# EAGLE schematic light_controller (EAGLE 8.5.0)
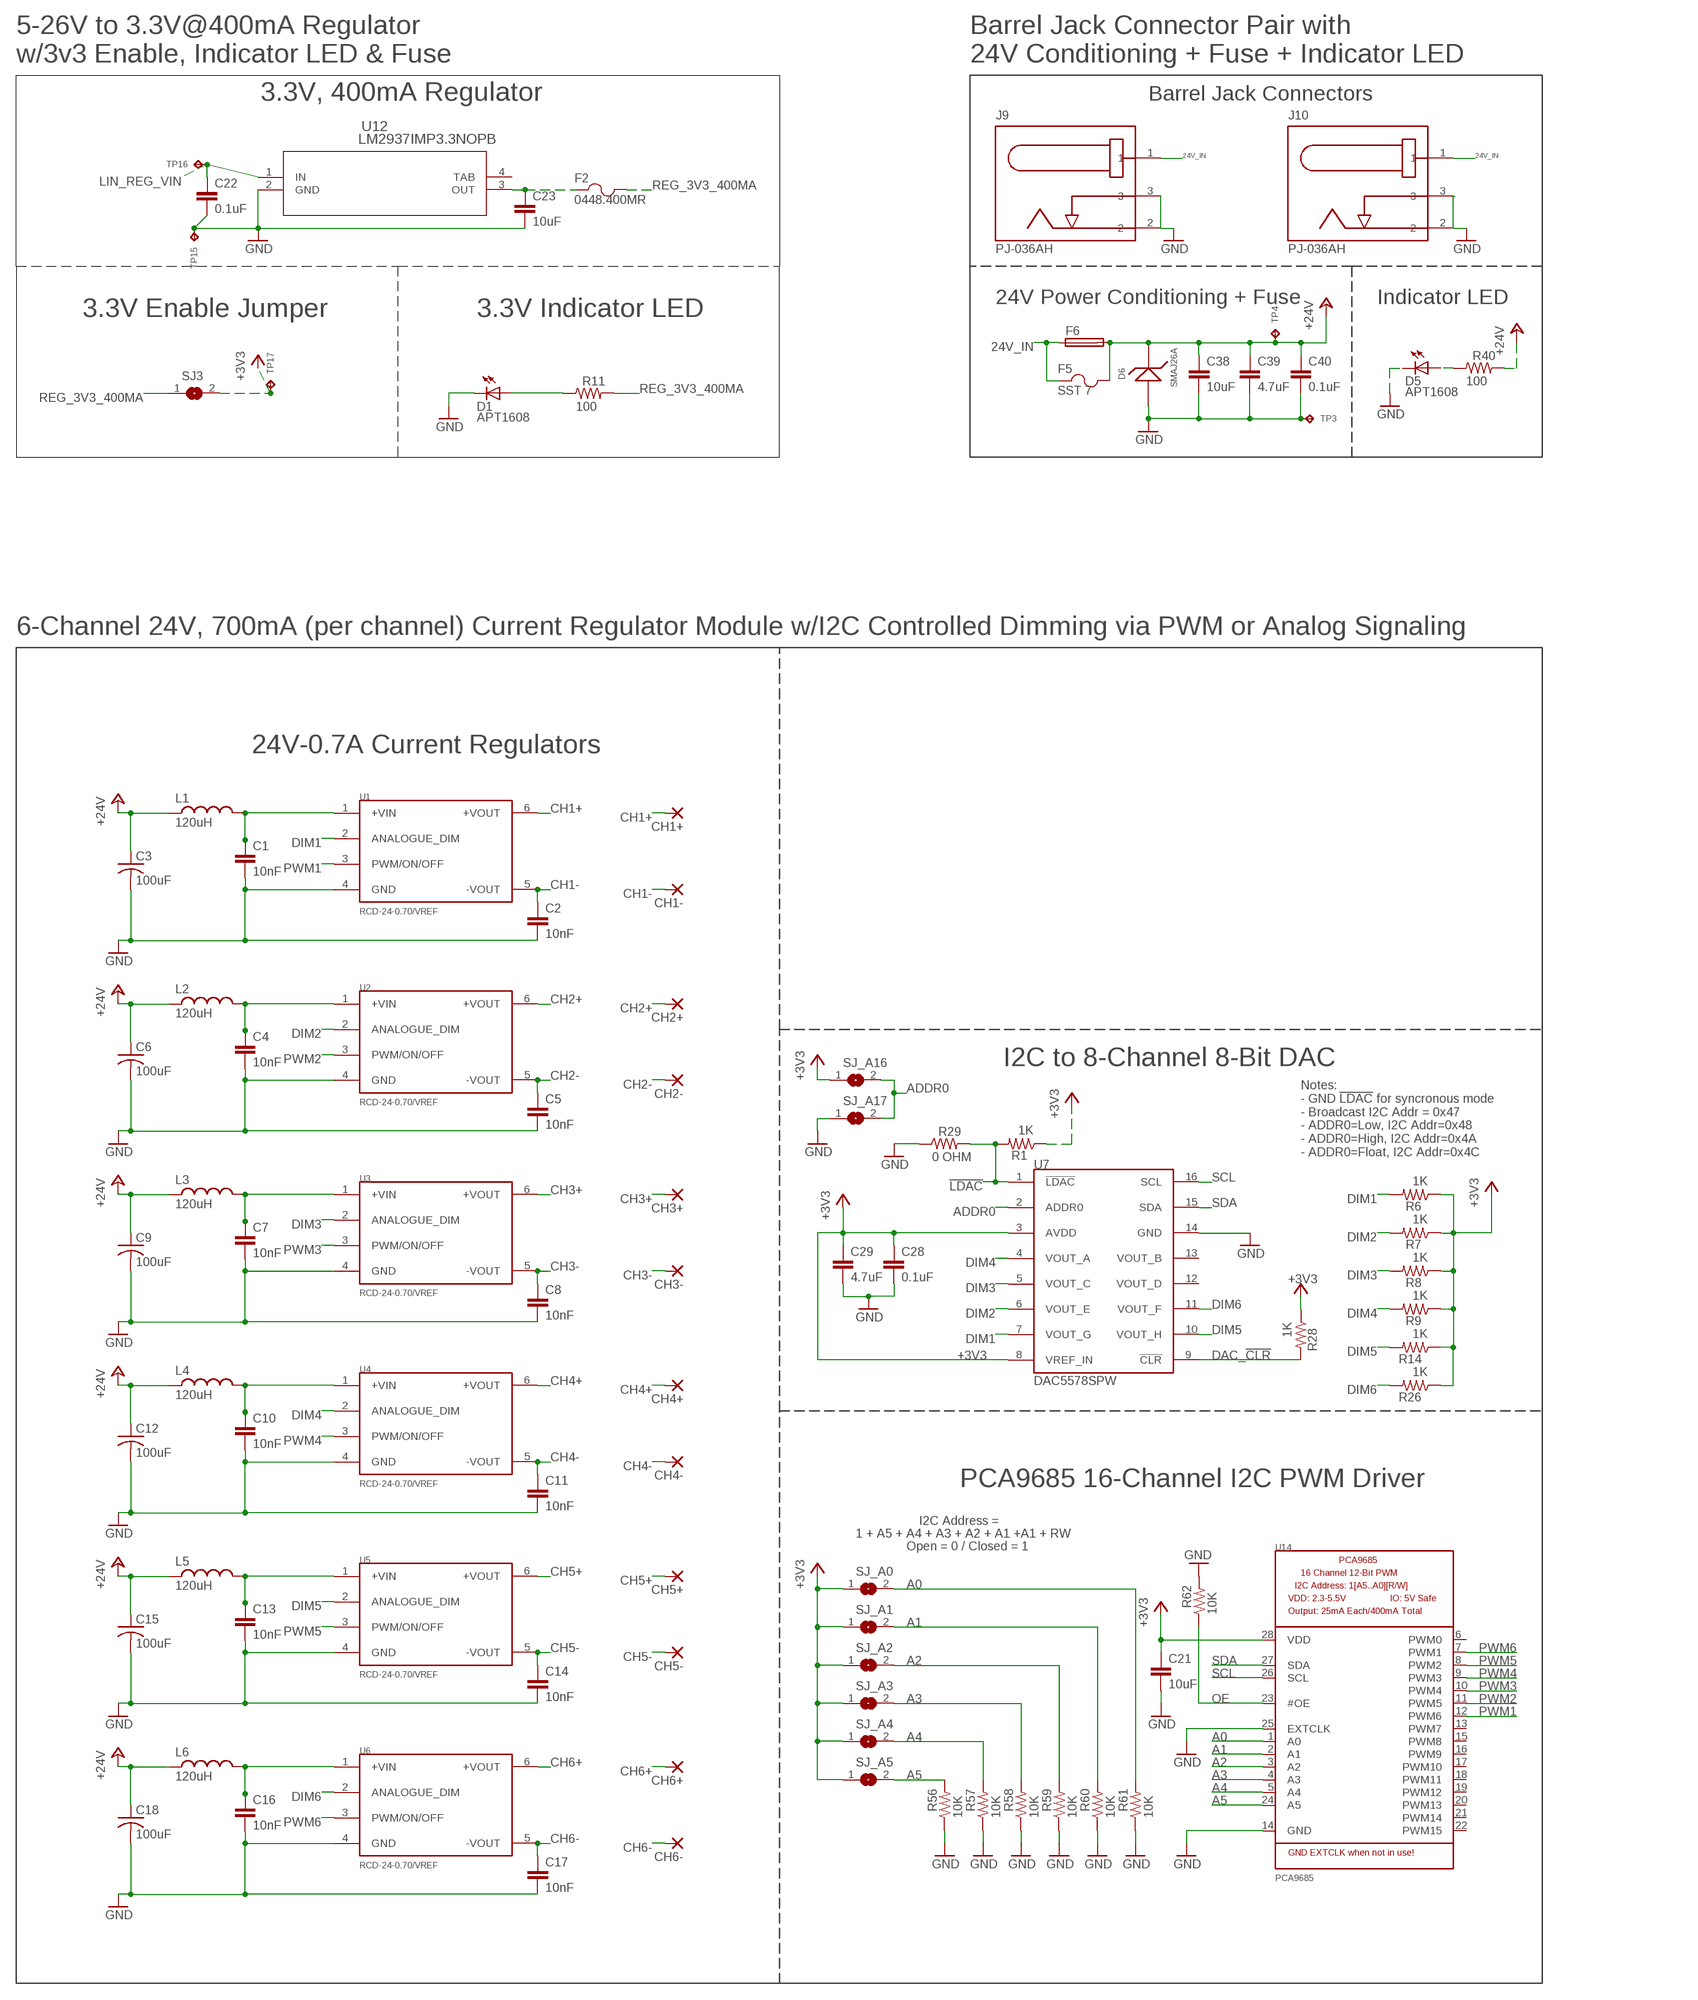
[diagram p0: schematic, sheet 1, part 1 of 2]
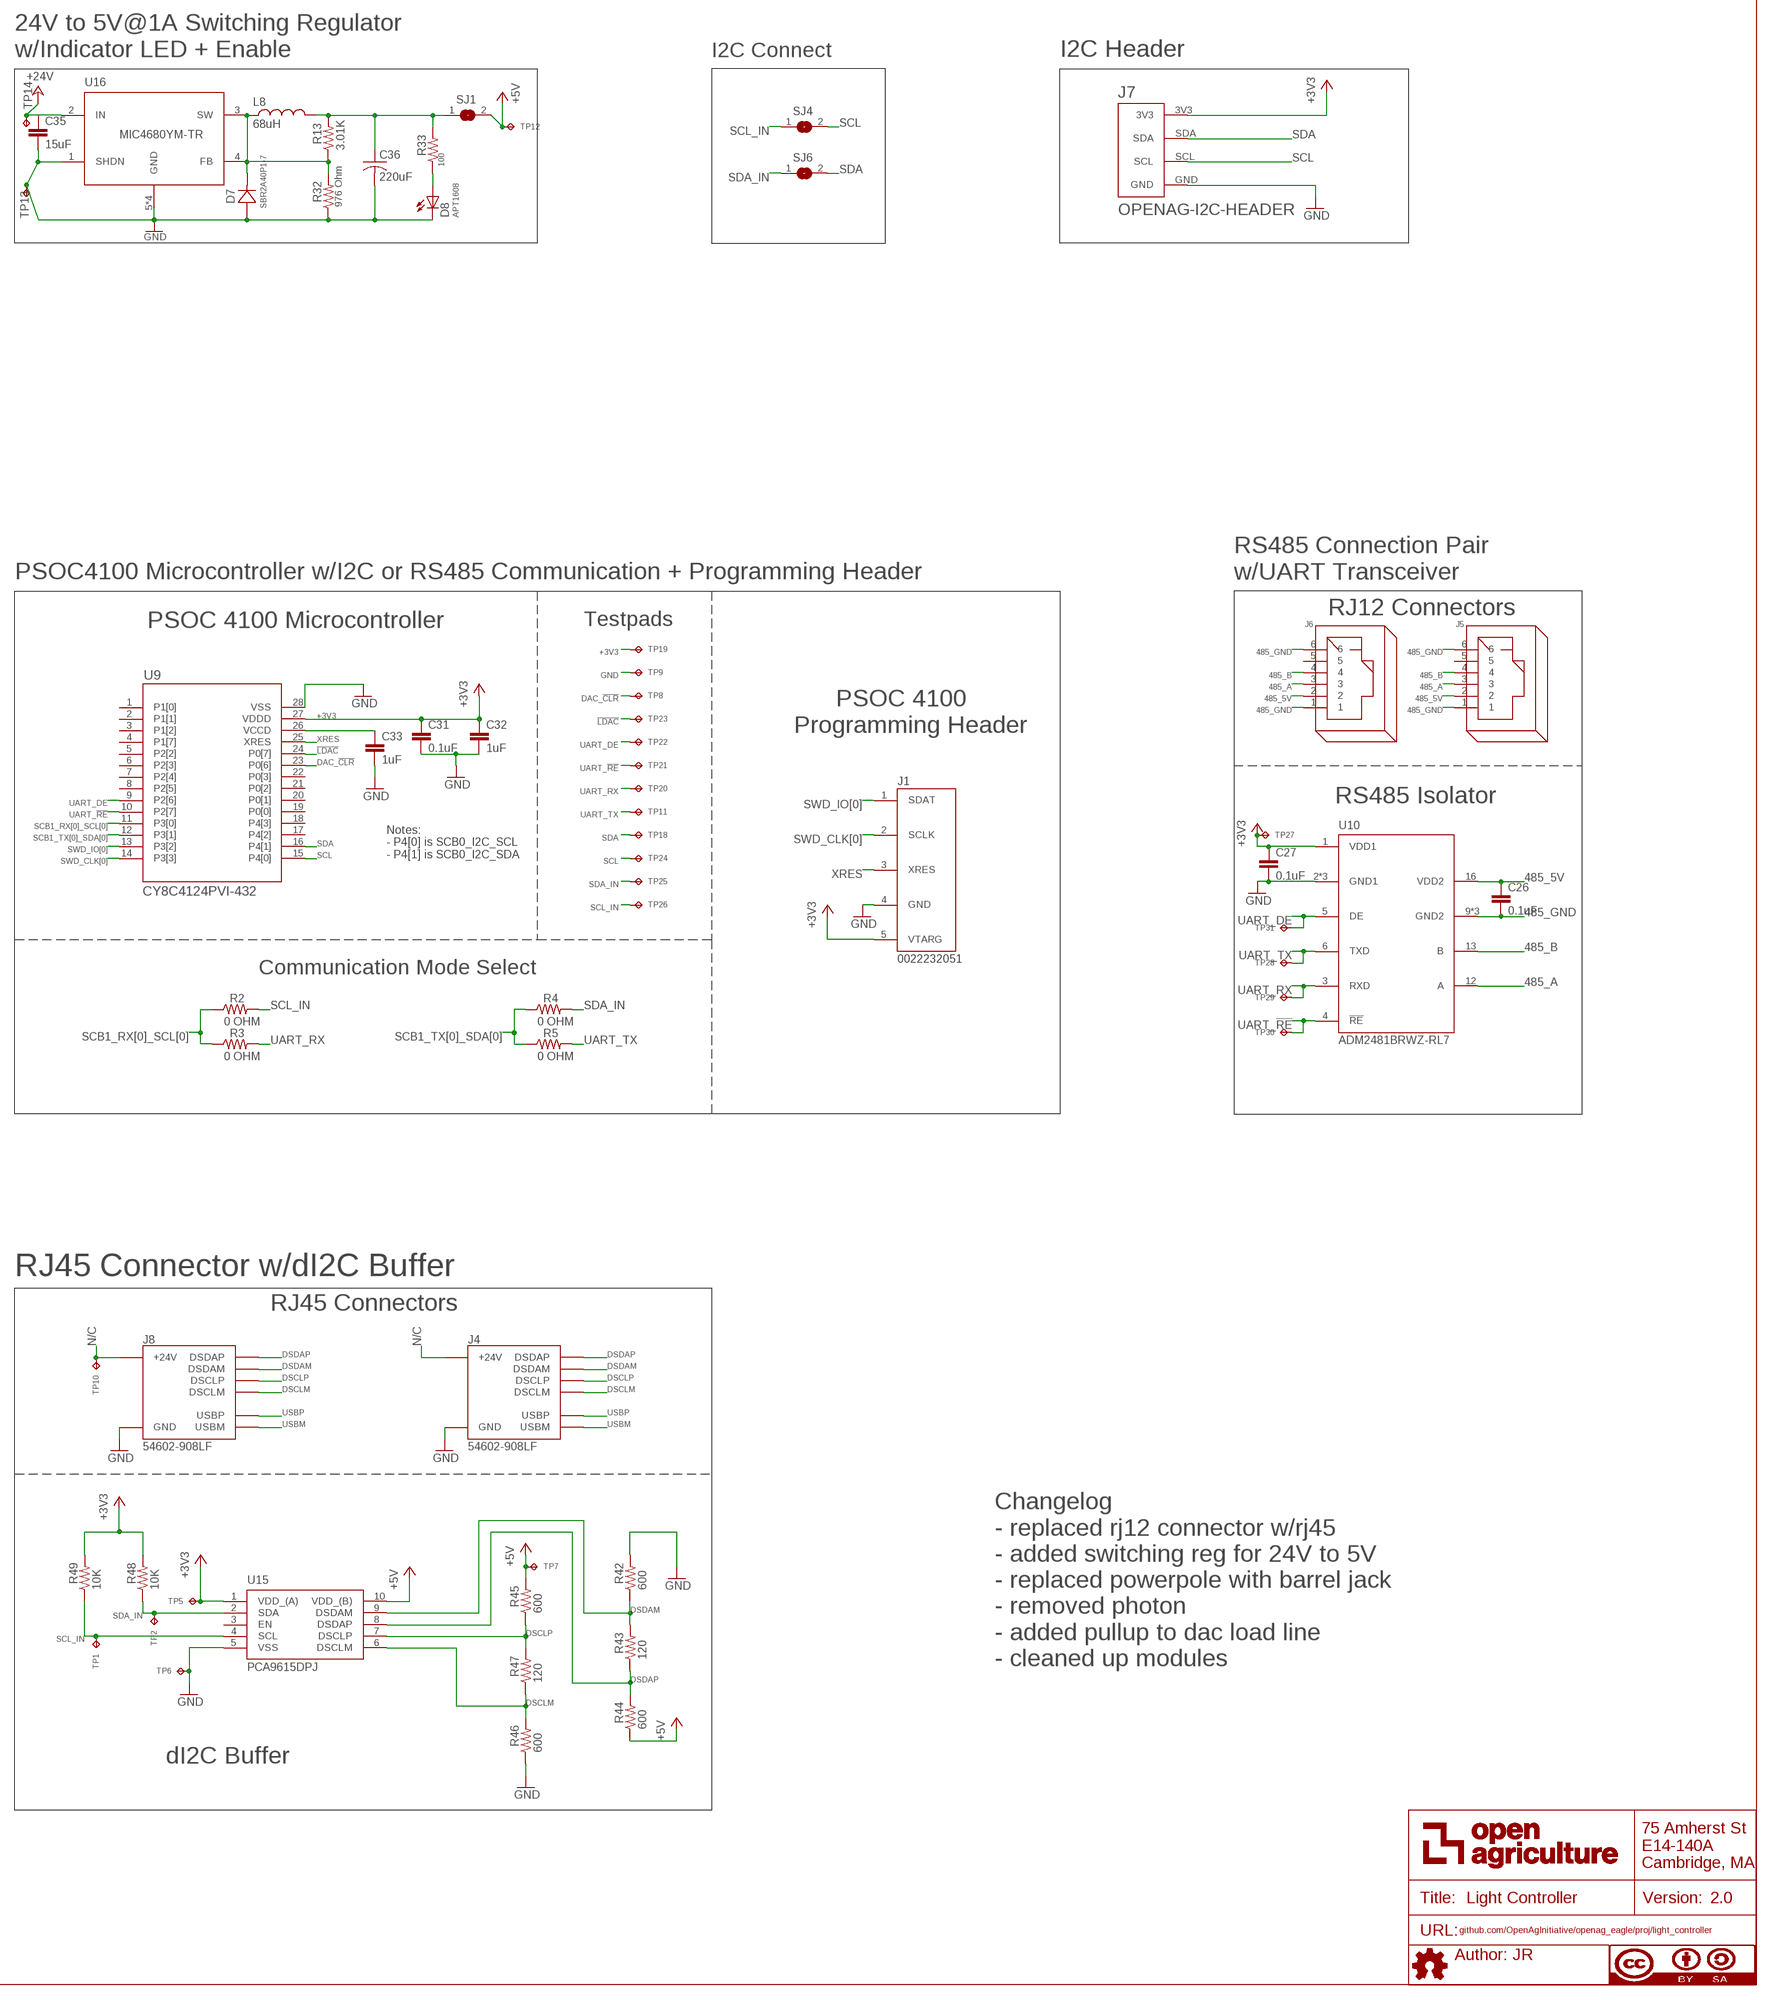
[diagram p1: schematic, sheet 1, part 2 of 2]

## Parts
C1  10nF  10NF-C0603C103K5RACTU  [C0603]
C2  10nF  10NF-C0603C103K5RACTU  [C0603]
C3  100uF  100UF-EEE-1HA101UP  [EEE-1HA101UP]
C4  10nF  10NF-C0603C103K5RACTU  [C0603]
C5  10nF  10NF-C0603C103K5RACTU  [C0603]
C6  100uF  100UF-EEE-1HA101UP  [EEE-1HA101UP]
C7  10nF  10NF-C0603C103K5RACTU  [C0603]
C8  10nF  10NF-C0603C103K5RACTU  [C0603]
C9  100uF  100UF-EEE-1HA101UP  [EEE-1HA101UP]
C10  10nF  10NF-C0603C103K5RACTU  [C0603]
C11  10nF  10NF-C0603C103K5RACTU  [C0603]
C12  100uF  100UF-EEE-1HA101UP  [EEE-1HA101UP]
C13  10nF  10NF-C0603C103K5RACTU  [C0603]
C14  10nF  10NF-C0603C103K5RACTU  [C0603]
C15  100uF  100UF-EEE-1HA101UP  [EEE-1HA101UP]
C16  10nF  10NF-C0603C103K5RACTU  [C0603]
C17  10nF  10NF-C0603C103K5RACTU  [C0603]
C18  100uF  100UF-EEE-1HA101UP  [EEE-1HA101UP]
C21  10uF  10UF-GMK212BBJ106KG-T  [C0805]
C22  0.1uF  0.1UF-C0603C104K5RACTU  [C0603]
C23  10uF  10UF-GMK212BBJ106KG-T  [C0805]
C26  0.1uF  0.1UF-C0603C104K5RACTU  [C0603]
C27  0.1uF  0.1UF-C0603C104K5RACTU  [C0603]
C28  0.1uF  0.1UF-C0603C104K5RACTU  [C0603]
C29  4.7uF  4.7UF-CL21A475KBQNNNE  [C0805]
C31  0.1uF  0.1UF-C0603C104K5RACTU  [C0603]
C32  1uF  1UF-CL10A105KB8NNNC  [C0603]
C33  1uF  1UF-CL10A105KB8NNNC  [C0603]
C35  15uF  15UF-C2012X5R1V156M125AC  [C0805]
C36  220uF  220UF-TPSY227K010R0100  [CT7343]
C38  10uF  10UF-GMK212BBJ106KG-T  [C0805]
C39  4.7uF  4.7UF-CL21A475KBQNNNE  [C0805]
C40  0.1uF  0.1UF-C0603C104K5RACTU  [C0603]
CH1+  3,17/1,3  [3,17/1,3]
CH1-  3,17/1,3  [3,17/1,3]
CH2+  3,17/1,3  [3,17/1,3]
CH2-  3,17/1,3  [3,17/1,3]
CH3+  3,17/1,3  [3,17/1,3]
CH3-  3,17/1,3  [3,17/1,3]
CH4+  3,17/1,3  [3,17/1,3]
CH4-  3,17/1,3  [3,17/1,3]
CH5+  3,17/1,3  [3,17/1,3]
CH5-  3,17/1,3  [3,17/1,3]
CH6+  3,17/1,3  [3,17/1,3]
CH6-  3,17/1,3  [3,17/1,3]
D1  APT1608  APT1608CGCK  [CHIPLED_0603]
D5  APT1608  APT1608CGCK  [CHIPLED_0603]
D6  SMAJ26A  SMAJ26A-13-F  [SMA]
D7  SBR2A40P1-7  [POWERDI123]
D8  APT1608  APT1608CGCK  [CHIPLED_0603]
F2  0448.400MR  0438.375WR  [0603]
F5  SST 7  SST_7  [SS]
F6  GSH15  [GSH15]
FRAME1  DOCFIELD  [DOCFIELD]
J1  0022232051  MINI-PROG3-5POS-MATING-CONNECTOR  [22-23-2051]
J4  54602-908LF  OPENAG-V1-RJ45PTH  [OPENAG-V1-RJ45]
J5  OPENAG-RS485-RJ12  [OPENAG-RS485-RJ12]
J6  OPENAG-RS485-RJ12  [OPENAG-RS485-RJ12]
J7  OPENAG-I2C-HEADER  [OPENAG-I2C-HEADER]
J8  54602-908LF  OPENAG-V1-RJ45PTH  [OPENAG-V1-RJ45]
J9  PJ-036AH  PJ-036AH-SMT-TR  [PJ-036AH]
J10  PJ-036AH  PJ-036AH-SMT-TR  [PJ-036AH]
L1  120uH  120UH-ASPI-6045S-121M-TCT-ND  [74404064121]
L2  120uH  120UH-ASPI-6045S-121M-TCT-ND  [74404064121]
L3  120uH  120UH-ASPI-6045S-121M-TCT-ND  [74404064121]
L4  120uH  120UH-ASPI-6045S-121M-TCT-ND  [74404064121]
L5  120uH  120UH-ASPI-6045S-121M-TCT-ND  [74404064121]
L6  120uH  120UH-ASPI-6045S-121M-TCT-ND  [74404064121]
L8  68uH  68UH-UP2B-680-R  [UP2B]
R1  1K  1K-ERJ-PB3D1001V  [RC0603N]
R2  0 OHM  0OHM-RC0603JR-070RL  [RC0603N]
R3  0 OHM  0OHM-RC0603JR-070RL  [RC0603N]
R4  0 OHM  0OHM-RC0603JR-070RL  [RC0603N]
R5  0 OHM  0OHM-RC0603JR-070RL  [RC0603N]
R6  1K  1K-ERJ-PB3D1001V  [RC0603N]
R7  1K  1K-ERJ-PB3D1001V  [RC0603N]
R8  1K  1K-ERJ-PB3D1001V  [RC0603N]
R9  1K  1K-ERJ-PB3D1001V  [RC0603N]
R11  100  100OHM-RC0603JR-07100RL  [RC0603N]
R13  3.01K  3.01K-RC0603FR-073K01L  [RC0603N]
R14  1K  1K-ERJ-PB3D1001V  [RC0603N]
R26  1K  1K-ERJ-PB3D1001V  [RC0603N]
R28  1K  1K-ERJ-PB3D1001V  [RC0603N]
R29  0 OHM  0OHM-RC0603JR-070RL  [RC0603N]
R32  976 Ohm  982OHM-RC0603FR-07976RL  [RC0603N]
R33  100  100OHM-RC0603JR-07100RL  [RC0603N]
R40  100  100OHM-RC0603JR-07100RL  [RC0603N]
R42  600  600OHM-RC0603FR-07604RL  [RC0603N]
R43  120  120OHM-RC0603FR-07120RL  [RC0603N]
R44  600  600OHM-RC0603FR-07604RL  [RC0603N]
R45  600  600OHM-RC0603FR-07604RL  [RC0603N]
R46  600  600OHM-RC0603FR-07604RL  [RC0603N]
R47  120  120OHM-RC0603FR-07120RL  [RC0603N]
R48  10K  10K-ERJ-3EKF1002V  [RC0603N]
R49  10K  10K-ERJ-3EKF1002V  [RC0603N]
R56  10K  10K-ERJ-3EKF1002V  [RC0603N]
R57  10K  10K-ERJ-3EKF1002V  [RC0603N]
R58  10K  10K-ERJ-3EKF1002V  [RC0603N]
R59  10K  10K-ERJ-3EKF1002V  [RC0603N]
R60  10K  10K-ERJ-3EKF1002V  [RC0603N]
R61  10K  10K-ERJ-3EKF1002V  [RC0603N]
R62  10K  10K-ERJ-3EKF1002V  [RC0603N]
SJ1  SOLDERJUMPERREFLOW_NOPASTE  [SOLDERJUMPER_REFLOW_NOPASTE]
SJ3  SOLDERJUMPERREFLOW_NOPASTE  [SOLDERJUMPER_REFLOW_NOPASTE]
SJ4  SOLDERJUMPERREFLOW_NOPASTE  [SOLDERJUMPER_REFLOW_NOPASTE]
SJ6  SOLDERJUMPERREFLOW_NOPASTE  [SOLDERJUMPER_REFLOW_NOPASTE]
SJ_A0  SOLDERJUMPERREFLOW_NOPASTE  [SOLDERJUMPER_REFLOW_NOPASTE]
SJ_A1  SOLDERJUMPERREFLOW_NOPASTE  [SOLDERJUMPER_REFLOW_NOPASTE]
SJ_A2  SOLDERJUMPERREFLOW_NOPASTE  [SOLDERJUMPER_REFLOW_NOPASTE]
SJ_A3  SOLDERJUMPERREFLOW_NOPASTE  [SOLDERJUMPER_REFLOW_NOPASTE]
SJ_A4  SOLDERJUMPERREFLOW_NOPASTE  [SOLDERJUMPER_REFLOW_NOPASTE]
SJ_A5  SOLDERJUMPERREFLOW_NOPASTE  [SOLDERJUMPER_REFLOW_NOPASTE]
SJ_A16  SOLDERJUMPERREFLOW_NOPASTE  [SOLDERJUMPER_REFLOW_NOPASTE]
SJ_A17  SOLDERJUMPERREFLOW_NOPASTE  [SOLDERJUMPER_REFLOW_NOPASTE]
TP1  TPTP06R  [TP06R]
TP2  TPTP06R  [TP06R]
TP3  TPTP06R  [TP06R]
TP4  TPTP06R  [TP06R]
TP5  TPTP06R  [TP06R]
TP6  TPTP06R  [TP06R]
TP7  TPTP06R  [TP06R]
TP8  TPTP04R  [TP04R]
TP9  TPTP04R  [TP04R]
TP10  TPTP06R  [TP06R]
TP11  TPTP04R  [TP04R]
TP12  TPTP06R  [TP06R]
TP13  TPTP06R  [TP06R]
TP14  TPTP06R  [TP06R]
TP15  TPTP06R  [TP06R]
TP16  TPTP06R  [TP06R]
TP17  TPTP06R  [TP06R]
TP18  TPTP04R  [TP04R]
TP19  TPTP04R  [TP04R]
TP20  TPTP04R  [TP04R]
TP21  TPTP04R  [TP04R]
TP22  TPTP04R  [TP04R]
TP23  TPTP04R  [TP04R]
TP24  TPTP04R  [TP04R]
TP25  TPTP04R  [TP04R]
TP26  TPTP04R  [TP04R]
TP27  TPTP04R  [TP04R]
TP28  TPTP04R  [TP04R]
TP29  TPTP04R  [TP04R]
TP30  TPTP04R  [TP04R]
TP31  TPTP04R  [TP04R]
U1  RCD-24-0.70/VREF  [RCD-24-PINNED]
U2  RCD-24-0.70/VREF  [RCD-24-PINNED]
U3  RCD-24-0.70/VREF  [RCD-24-PINNED]
U4  RCD-24-0.70/VREF  [RCD-24-PINNED]
U5  RCD-24-0.70/VREF  [RCD-24-PINNED]
U6  RCD-24-0.70/VREF  [RCD-24-PINNED]
U7  DAC5578SPW  [TSSOP16]
U9  CY8C4124PVI-432  [SSOP-28]
U10  ADM2481BRWZ-RL7  [SOIC16LWB]
U12  LM2937IMP3.3NOPB  LM2937IMP-3.3/NOPB  [MP04A]
U14  PCA9685  PCA9685PW/Q900,118  [TSSOP28]
U15  PCA9615DPJ  [SOP50P490X110-10N]
U16  MIC4680YM-TR  [SOIC8]

## Nets
24V_IN: F5.1 F6.1 J9.1 J10.1
485_5V: C26.1 J5.2 J6.2 U10.16(VDD2)
485_A: J5.3 J6.3 U10.12(A)
485_B: J5.4 J6.4 U10.13(B)
485_GND: C26.2 J5.1 J5.6 J6.1 J6.6 U10.9(GND2) U10.10(GND2) U10.15(GND2)
!LDAC!: R1.2 R29.2 TP23.1(TP) U7.1(!LDAC!) U9.24(P0[7])
+3V3: C21.1 C27.1 C28.1 C29.1 C31.1 C32.1 J1.5(VTARG) J7.3V3 R1.1 R6.1 R7.1 R8.1 R9.1 R14.1 R26.1 R28.1 R48.2 R49.2 SJ3.2 SJ_A0.1 SJ_A1.1 SJ_A2.1 SJ_A3.1 SJ_A4.1 SJ_A5.1 SJ_A16.1 TP5.TP TP17.TP TP19.1(TP) TP27.1(TP) U7.3(AVDD) U7.8(VREF_IN) U9.27(VDDD) U10.1(VDD1) U14.28(VDD) U15.1(VDD_(A))
+5V: R44.1 R45.2 SJ1.2 TP7.TP TP12.TP U15.10(VDD_(B))
+24V: C3.+(1(+)) C6.+(1(+)) C9.+(1(+)) C12.+(1(+)) C15.+(1(+)) C18.+(1(+)) C35.1 C38.1 C39.1 C40.1 D6.1 F5.2 F6.2 L1.1 L2.1 L3.1 L4.1 L5.1 L6.1 R40.2 TP4.TP TP14.TP U16.2(IN)
A0: R61.2 SJ_A0.2 U14.1(A0)
A1: R60.2 SJ_A1.2 U14.2(A1)
A2: R59.2 SJ_A2.2 U14.3(A2)
A3: R58.2 SJ_A3.2 U14.4(A3)
A4: R57.2 SJ_A4.2 U14.5(A4)
A5: R56.2 SJ_A5.2 U14.24(A5)
ADDR0: SJ_A16.2 SJ_A17.2 U7.2(ADDR0)
CH1+: CH1+.1(P) U1.6(+VOUT)
CH1-: C2.1 CH1-.1(P) U1.5(-VOUT)
CH2+: CH2+.1(P) U2.6(+VOUT)
CH2-: C5.1 CH2-.1(P) U2.5(-VOUT)
CH3+: CH3+.1(P) U3.6(+VOUT)
CH3-: C8.1 CH3-.1(P) U3.5(-VOUT)
CH4+: CH4+.1(P) U4.6(+VOUT)
CH4-: C11.1 CH4-.1(P) U4.5(-VOUT)
CH5+: CH5+.1(P) U5.6(+VOUT)
CH5-: C14.1 CH5-.1(P) U5.5(-VOUT)
CH6+: CH6+.1(P) U6.6(+VOUT)
CH6-: C17.1 CH6-.1(P) U6.5(-VOUT)
DAC_!CLR!: R28.2 TP8.1(TP) U7.9(!CLR!) U9.23(P0[6])
DIM1: R6.2 U1.2(ANALOGUE_DIM) U7.7(VOUT_G)
DIM2: R7.2 U2.2(ANALOGUE_DIM) U7.6(VOUT_E)
DIM3: R8.2 U3.2(ANALOGUE_DIM) U7.5(VOUT_C)
DIM4: R9.2 U4.2(ANALOGUE_DIM) U7.4(VOUT_A)
DIM5: R14.2 U5.2(ANALOGUE_DIM) U7.10(VOUT_H)
DIM6: R26.2 U6.2(ANALOGUE_DIM) U7.11(VOUT_F)
DSCLM: J4.DSCLM(5)(DSCLM) J8.DSCLM(5)(DSCLM) R46.2 R47.1 U15.6(DSCLM)
DSCLP: J4.DSCLP(4)(DSCLP) J8.DSCLP(4)(DSCLP) R45.1 R47.2 U15.7(DSCLP)
DSDAM: J4.DSDAM(2)(DSDAM) J8.DSDAM(2)(DSDAM) R42.1 R43.2 U15.9(DSDAM)
DSDAP: J4.DSDAP(1)(DSDAP) J8.DSDAP(1)(DSDAP) R43.1 R44.2 U15.8(DSDAP)
GND: C1.2 C2.2 C3.-(2(-)) C4.2 C5.2 C6.-(2(-)) C7.2 C8.2 C9.-(2(-)) C10.2 C11.2 C12.-(2(-)) C13.2 C14.2 C15.-(2(-)) C16.2 C17.2 C18.-(2(-)) C21.2 C22.2 C23.2 C27.2 C28.2 C29.2 C31.2 C32.2 C33.2 C35.2 C36.-(2(-)) C38.2 C39.2 C40.2 D1.C D5.C D6.2 D7.- D8.C J1.4(GND) J4.GND(3)(GND) J7.GND J8.GND(3)(GND) J9.2 J9.3 J10.2 J10.3 R29.1 R32.1 R42.2 R46.1 R56.1 R57.1 R58.1 R59.1 R60.1 R61.1 R62.2 SJ_A17.1 TP3.TP TP6.TP TP9.1(TP) TP13.TP TP15.TP U1.4(GND) U2.4(GND) U3.4(GND) U4.4(GND) U5.4(GND) U6.4(GND) U7.14(GND) U9.28(VSS) U10.2(GND1) U10.7(GND1) U10.8(GND1) U12.2(GND) U14.14(GND) U14.25(EXTCLK) U15.5(VSS) U16.1(SHDN) U16.5(GND) U16.6(GND) U16.7(GND) U16.8(GND)
LIN_REG_VIN: C22.1 TP16.TP U12.1(IN)
N$1: C1.1 L1.2 U1.1(+VIN)
N$2: C4.1 L2.2 U2.1(+VIN)
N$4: C7.1 L3.2 U3.1(+VIN)
N$5: C10.1 L4.2 U4.1(+VIN)
N$6: C13.1 L5.2 U5.1(+VIN)
N$7: C16.1 L6.2 U6.1(+VIN)
N$10: D1.A R11.1
N$11: D7.+ L8.1 R13.1 R32.2 U16.3(SW) U16.4(FB)
N$12: C23.1 F2.1 U12.3(OUT)
N$22: D8.A R33.1
N$23: C33.1 U9.26(VCCD)
N$24: C36.+(1(+)) L8.2 R13.2 R33.2 SJ1.1
N$26: D5.A R40.1
N/C: J4.24V(6)(+24V) J8.24V(6)(+24V) TP10.TP
OE: R62.1 U14.23(#OE)
PWM1: U1.3(PWM/ON/OFF) U14.12(PWM6)
PWM2: U2.3(PWM/ON/OFF) U14.11(PWM5)
PWM3: U3.3(PWM/ON/OFF) U14.10(PWM4)
PWM4: U4.3(PWM/ON/OFF) U14.9(PWM3)
PWM5: U5.3(PWM/ON/OFF) U14.8(PWM2)
PWM6: U6.3(PWM/ON/OFF) U14.7(PWM1)
REG_3V3_400MA: F2.2 R11.2 SJ3.1
SCB1_RX[0]_SCL[0]: R2.1 R3.1 U9.11(P3[0])
SCB1_TX[0]_SDA[0]: R4.1 R5.1 U9.12(P3[1])
SCL: J7.SCL SJ4.2 TP24.1(TP) U7.16(SCL) U9.15(P4[0]) U14.26(SCL)
SCL_IN: R2.2 R49.1 SJ4.1 TP1.TP TP26.1(TP) U15.4(SCL)
SDA: J7.SDA SJ6.2 TP18.1(TP) U7.15(SDA) U9.16(P4[1]) U14.27(SDA)
SDA_IN: R4.2 R48.1 SJ6.1 TP2.TP TP25.1(TP) U15.2(SDA)
SWD_CLK[0]: J1.2(SCLK) U9.14(P3[3])
SWD_IO[0]: J1.1(SDAT) U9.13(P3[2])
UART_!RE!: TP21.1(TP) TP30.1(TP) U9.10(P2[7]) U10.4(!RE!)
UART_DE: TP22.1(TP) TP31.1(TP) U9.9(P2[6]) U10.5(DE)
UART_RX: R3.2 TP20.1(TP) TP29.1(TP) U10.3(RXD)
UART_TX: R5.2 TP11.1(TP) TP28.1(TP) U10.6(TXD)
USBM: J4.USBM(8)(USBM) J8.USBM(8)(USBM)
USBP: J4.USBP(7)(USBP) J8.USBP(7)(USBP)
XRES: J1.3(XRES) U9.25(XRES)
Unconnected: J5.5 J6.5 U7.12(VOUT_D) U7.13(VOUT_B) U9.1(P1[0]) U9.2(P1[1]) U9.3(P1[2]) U9.4(P1[7]) U9.5(P2[2]) U9.6(P2[3]) U9.7(P2[4]) U9.8(P2[5]) U9.17(P4[2]) U9.18(P4[3]) U9.19(P0[0]) U9.20(P0[1]) U9.21(P0[2]) U9.22(P0[3]) U14.6(PWM0) U14.13(PWM7) U14.15(PWM8) U14.16(PWM9) U14.17(PWM10) U14.18(PWM11) U14.19(PWM12) U14.20(PWM13) U14.21(PWM14) U14.22(PWM15) U15.3(EN)

## Notes on the sheet
- 5-26V to 3.3V@400mA Regulator 
  w/3v3 Enable, Indicator LED & Fuse
- Barrel Jack Connector Pair with 
  24V Conditioning + Fuse + Indicator LED
- 24V to 5V@1A Switching Regulator
  w/Indicator LED + Enable
- I2C Connect | I2C Header
- 3.3V, 400mA Regulator | Barrel Jack Connectors
- 24V Power Conditioning + Fuse | Indicator LED
- 3.3V Enable Jumper | 3.3V Indicator LED
- 6-Channel 24V, 700mA (per channel) Current Regulator Module w/I2C Controlled Dimming via PWM or Analog Signaling | PSOC4100 Microcontroller w/I2C or RS485 Communication + Programming Header
- RS485 Connection Pair 
  w/UART Transceiver
- RJ12 Connectors
- PSOC 4100 Microcontroller | Testpads
- 24V-0.7A Current Regulators
- PSOC 4100 
  Programming Header
- RS485 Isolator
- Notes:
  - P4[0] is SCB0_I2C_SCL
  - P4[1] is SCB0_I2C_SDA
- I2C to 8-Channel 8-Bit DAC | Communication Mode Select
- Notes:
  - GND !LDAC! for syncronous mode
  - Broadcast I2C Addr = 0x47
  - ADDR0=Low, I2C Addr=0x48
  - ADDR0=High, I2C Addr=0x4A
  - ADDR0=Float, I2C Addr=0x4C
- RJ45 Connector w/dI2C Buffer
- RJ45 Connectors
- PCA9685 16-Channel I2C PWM Driver
- I2C Address =
- 1 + A5 + A4 + A3 + A2 + A1 +A1 + RW
- Open = 0 / Closed = 1
- Changelog
  - replaced rj12 connector w/rj45
  - added switching reg for 24V to 5V
  - replaced powerpole with barrel jack
  - removed photon
  - added pullup to dac load line
  - cleaned up modules
- dI2C Buffer

## Power pins joined to a net without a drawn wire
TAB: U12.4(TAB)

## Library data of the parts
C1 C2 C4 C5 C7 C8 C10 C11 C13 C14 C16 C17 = openag-capacitors:10NF-C0603C103K5RACTU: KEMET - C0603C103K5RACTU - CAP CER 10000PF 50V X7R 0603 Description: 10000pF ±10% 50V Ceramic Capacitor X7R 0603 (1608 Metric) Technical Specifications: Capacitance: 10000pF Tolerance: ±10% Voltage - Rated: 50V Temperature Coefficient: X7R Operating Temperature: -55°C ~ 125°C Applications: General Purpose Mounting Type: Surface Mount, MLCC Package / Case: 0603 (1608 Metric) Size / Dimension: 0.063" L x 0.032" W (1.60mm x 0.80mm) Thickness (Max): 0.034" (0.87mm) Datasheet(s): X7R Dielectric, 6.3-250 VDC Vendor(s): Digikey: 399-1091-1-ND; POPULATE: YES; VERIFIED: NO
C3 C6 C9 C12 C15 C18 = openag-capacitors:100UF-EEE-1HA101UP: Panasonic - EEE-1HA101UP - ELECTROLYTIC CAP ALUM 100UF 20% 50V SMD Description: 100µF 50V Aluminum Electrolytic Capacitors Radial, Can - SMD 2000 Hrs @ 85°C Technical Specifications: Capacitance: 100uF Tolerance: ±20% Rated Voltage: 50V Polarization: Polar Operating Temperature: -40°C ~ 85°C Datasheet(s): S Series, Type V <https://industrial.panasonic.com/cdbs/www-data/pdf/RDE0000/ABA0000C1145.pdf> Vendor(s): Digikey: PCE3917CT-ND <https://www.digikey.com/product-detail/en/panasonic-electronic-components/EEE-1HA101UP/PCE3917CT-ND/766293>; POPULATE: YES; VERIFIED: NO
C21 C23 C38 = openag-capacitors:10UF-GMK212BBJ106KG-T: Taiyo Yuden - GMK212BBJ106KG-T - CAP CER 10UF 35V X5R 0805 Description: 10µF ±10% 35V Ceramic Capacitor X5R 0805 (2012 Metric) Technical Specifications: Capacitance: 10µF Tolerance: ±10% Rated Voltage: 35V Temperature Coefficient: X5R Operating Temperature: -55°C ~ 85°C Package / Case: 0805 (2012 Metric) Datasheet(s): GMK212BBJ106KG-T Spec Vendor(s): Digikey: 587-4893-1-ND; POPULATE: YES; VERIFIED: NO
C22 C26-C28 C31 C40 = openag-capacitors:0.1UF-C0603C104K5RACTU: Kemet - C0603C104K5RACTU - CAP CER 0.1UF 50V X7R 0603 Description: 0.1µF ±10% 50V Ceramic Capacitor X7R 0603 (1608 Metric) Technical Specifications: Capacitance: 0.1µF Tolerance: ±10% Rated Voltage: 50V Temperature Coefficient: X7R Operating Temperature: -55°C ~ 125°C Package / Case: 0603 (1608 Metric) Datasheet(s): X7R Dielectric, 6.3-250 VDC Vendor(s): Digikey: 399-5089-1-ND; POPULATE: YES; VERIFIED: NO
C29 C39 = openag-capacitors:4.7UF-CL21A475KBQNNNE: Samsung - CL21A475KBQNNNE - CAP CER 4.7UF 50V X5R 0805 Description: 4.7µF ±10% 50V Ceramic Capacitor X5R 0805 (2012 Metric) Technical Specifications: Capacitance: 4.7uF Tolerance: ±10% Rated Voltage: 50V Temperature Coefficient: X5R Operating Temperature: -55°C ~ 85°C Package/Case: 0805 (2012 Metric) Datasheet(s): CL21A475KBQNNNE Characteristics Vendor(s): Digikey: 1276-1248-1-ND; POPULATE: YES; VERIFIED: NO
C32 C33 = openag-capacitors:1UF-CL10A105KB8NNNC: Samsung - CL10A105KB8NNNC - CAP CER 1UF 50V X5R 0603 Description: 1µF ±10% 50V Ceramic Capacitor X5R 0603 (1608 Metric) Technical Specifications: Capacitance: 1µF Tolerance: ±10% Rated Voltage: 50V Temperature Coefficient: X5R Operating Temperature: -55°C ~ 85°C Packaging / Case: 0603 (1608 Metric) Datasheet(s): CL10A105KB8NNNC Spec Vendor(s): Digikey: 1276-1860-1-ND; POPULATE: YES; VERIFIED: NO
C35 = openag-capacitors:15UF-C2012X5R1V156M125AC: TDK Corporation - C2012X5R1V156M125AC - CAP CER 15UF 35V X5R 0805 Description: 15µF ±20% 35V Ceramic Capacitor X5R 0805 (2012 Metric) Technical Specifications: Capacitance: 15µF Tolerance: ±20% Voltage - Rated: 35V Temperature Coefficient: X5R Operating Temperature: -55°C ~ 85°C Features: Low ESL Applications: General Purpose Mounting Type: Surface Mount, MLCC Package / Case: 0805 (2012 Metric) Size / Dimension: 0.079" L x 0.049" W (2.00mm x 1.25mm) Thickness (Max): 0.057" (1.45mm) Datasheet(s): C Series, General Datasheet MLCC Part Number Guide C Series, Gen Appl & Mid-Voltage Spec Vendor(s): Digikey: 445-14423-1-ND
C36 = openag-capacitors:220UF-TPSY227K010R0100: AVX Corporation - TPSY227K010R0100 - CAP TANT 220UF 10V 10% 2917 Description: 220µF Molded Tantalum Capacitors 10V 2917 (7343 Metric) 100 mOhm Technical Specifications: Capacitance: 220µF Tolerance: ±10% Voltage - Rated: 10V Type: Molded ESR (Equivalent Series Resistance): 100 mOhm Operating Temperature: -55°C ~ 125°C Mounting Type: Surface Mount Package / Case: 2917 (7343 Metric) Size / Dimension: 0.287" L x 0.169" W (7.30mm x 4.30mm) Height - Seated (Max): 0.079" (2.00mm) Manufacturer Size Code: Y Features: General Purpose Datasheet(s): TPS Series, Low ESR Vendor(s): Digikey: 478-5408-1-ND
CH1+ CH1- CH2+ CH2- CH3+ CH3- CH4+ CH4- CH5+ CH5- CH6+ CH6- = openag-wirepads:3,17/1,3: THROUGH-HOLE PAD
D1 D5 D8 = openag-diodes:APT1608CGCK: Kingbright - APT1608CGCK - LED GREEN CLEAR 0603 SMD Description: Green 570nm LED Indication - Discrete 2.1V 0603 (1608 Metric) Technical Specifications: Color: Green Lens Color: Colorless Lens Transparency: Clear Millicandela Rating: 50mcd Lens Style/Size: Rectangle with Flat Top, 1.20mm x 0.80mm Voltage - Forward (Vf) (Typ): 2.1V Current - Test: 20mA Viewing Angle: 120° Mounting Type: Surface Mount Wavelength - Dominant: 570nm Wavelength - Peak: 574nm Package / Case: 0603 (1608 Metric) Supplier Device Package: Chip LED Size / Dimension: 1.60mm L x 0.80mm W Height (Max): 0.75mm Datasheet(s): APT1608CGCK Vendor(s): Digikey: 754-1116-1-ND; POPULATE: YES; VERIFIED: NO
D6 = openag-diodes:SMAJ26A-13-F: Diodes Incorporated - SMAJ26A-13-F - TVS DIODE 26VWM 42.1VC SMA Description: TVS DIODE 26VWM 42.1VC SMA Technical Specifications: Type: Zener Voltage - Reverse Standoff (Typ): 26V Voltage - Breakdown (Min): 28.9V Voltage - Clamping (Max) @ Ipp: 42.1V Current - Peak Pulse (10/1000µs): 9.5A Power - Peak Pulse: 400W Power Line Protection: No Operating Temperature: -55°C ~ 150°C (TJ) DO-214AC, SMA Datasheet(s): SMAJ5.0(C)A - SMAJ200(C)A Vendor(s): Digikey: SMAJ26A-FDICT-ND
D7 = openag-diodes:SBR2A40P1-7: Diodes Incorporated - SBR2A40P1-7 - DIODE SBR 40V 2A POWERDI123 Description: Diode Super Barrier 40V 2A Surface Mount PowerDI™ 123 Technical Specifications: Diode Type: Super Barrier Voltage - DC Reverse (Vr) (Max): 40V Current - Average Rectified (Io): 2A Voltage - Forward (Vf) (Max) @ If: 500mV @ 2A Speed: Standard Recovery >500ns, > 200mA (Io) Current - Reverse Leakage @ Vr: 100µA @ 40V Mounting Type: Surface Mount Package / Case: POWERDI®123 Supplier Device Package: PowerDI™ 123 Operating Temperature - Junction: -65°C ~ 150°C Base Part Number: SBR2A40 Datasheet(s): SBR2A40P1 Vendor(s): Digikey: SBR2A40P1DITR-ND
F2 = openag-fuses:0438.375WR: Littelfuse Inc. - 0448.400MR - FUSE BOARD MNT 400MA 125VAC/VDC Description: FUSE BOARD MNT 400MA 125VAC/VDC Technical Specifications: Fuse Type: Board Mount (Cartridge Style Excluded) Current Rating: 400mA Voltage Rating - AC: 125V Voltage Rating - DC: 125V Response Time: Fast Package / Case: 2-SMD, Square End Block Mounting Type: Surface Mount Breaking Capacity @ Rated Voltage: 50A Melting I²t: 0.0416 Approvals: CSA, UL Operating Temperature: -55°C ~ 125°C Size / Dimension: 0.240" L x 0.106" W x 0.106" H (6.10mm x 2.69mm x 2.69mm) DC Cold Resistance: 0.4895 Ohms Datasheet(s): 448 Series Datasheet Vendor(s): Digikey: F5573CT-ND; POPULATE: YES; VERIFIED: YES
F5 = openag-fuses:SST_7: Bel Fuse - SST7 - FUSE BRD MNT 7A 125VAC/VDC 2SMD Description: FUSE BRD MNT 7A 125VAC/VDC 2SMD Technical Specifications: Current Rating: 7A Voltage Rating: 125V Fuse Type: Board Mount (Cartridge Style Excluded) Mounting Type: Surface Mount Operating Temperature: -55°C ~ 125°C Datasheet(s): SST Type Vendor(s): Digikey: 507-1072-1-ND; POPULATE: YES; VERIFIED: NO
F6 = fuse:GSH15: FUSE HOLDER grid 15mm, 19649 Wickmann; MPN: 64900001039; OC_FARNELL: 1271673; OC_NEWARK: 02P0318
FRAME1 = openag-frames:DOCFIELD: DOCUMENT FIELD; AUTHOR: JR; DESCRIPTION: Controls 6 channels of 24V, 700mA for LED strings that can be interfaced via i2c, rs485, and/or wifi.; TITLE: Light Controller; URL: github.com/OpenAgInitiative/openag_eagle/proj/light_controller; VER: 2.0
J1 = openag-connectors:MINI-PROG3-5POS-MATING-CONNECTOR: Molex - 0022232051 - CONN HEADER 5POS .100 VERT TIN Description: 5 Positions Header Connector 0.100" (2.54mm) Through Hole Tin This is the specified mating connector for programming a PSOC microcontroller with the MiniProg3 Programmer Technical Specifications: Connector Type: Header Contact Type: Male Pin Pitch - Mating: 0.100" (2.54mm) Number of Positions: 5 Number of Rows: 1 Mounting Type: Through Hole Fastening Type: Friction Lock Datasheet(s): Molex 22-23-2051 <http://www.molex.com/pdm_docs/sd/022232051_sd.pdf> Cypress CY8CKIT-002 Brief <http://www.cypress.com/file/44091/download> Vendor(s): Digikey: WM4203-ND (Molex Connector) <https://www.digikey.com/products/en?keywords=22-23-2051> Digikey: 428-2975-ND (Cypress Programmer Kit) <https://www.digikey.com/product-detail/en/cypress-semiconductor-corp/CY8CKIT-002/428-2975-ND/2126344>; POPULATE: YES; VERIFIED: NO
J4 J8 = openag_connector:OPENAG-V1-RJ45: Amphenol FCI - 54602-908LF - CONN MOD JACK 8P8C R/A UNSHLD Description: Jack Modular Connector 8p8c (RJ45, Ethernet) 90� Angle (Right) Unshielded Cat3 Technical Specifications: Connector Type: Jack Number of Positions/Contacts: 8p8c (RJ45, Ethernet) Number of Ports: 1 Number of Rows: 1 Mounting Type: Through Hole Orientation: 90� Angle (Right) Termination: Solder Shielding: Unshielded Ratings: Cat3 Features: Board Lock LED Color: Does Not Contain LED Tab Direction: Down Contact Material: Copper Alloy Contact Finish: Gold Contact Finish Thickness: 15�in (0.38�m) Housing Material: Polyester, Glass Filled Operating Temperature: -40�C ~ 70�C Datasheet(s): 54601-x04(zzz)WPLF Drawing Vendor(s): Digikey: 609-1046-ND; POPULATE: YES; VERIFIED: NO
J5 J6 = openag-connectors:OPENAG-RS485-RJ12: Assmann WSW Components - A-2004-1-4-LP-N-R - RJ12 CONN MOD JACK 6P6C R/A UNSHLD Description: Jack Modular Connector 6p6c (RJ11, RJ12, RJ14, RJ25) 90° Angle (Right) Unshielded Technical Specifications: Connector Type: Jack Number of Positions/Contacts: 6p6c (RJ11, RJ12, RJ14, RJ25) Number of Ports: 1 Number of Rows: 1 Mounting Type: Through Hole Orientation: 90° Angle (Right) Termination: Solder Shielding: Unshielded Features: Board Lock LED Color: Does Not Contain LED Tab Direction: Down Contact Material: Phosphor Bronze Contact Finish: Gold Contact Finish Thickness: 6µin (0.152µm) Housing Material: Polybutylene Terephthalate (PBT), Glass Filled Operating Temperature: -40°C ~ 85°C Datasheet(s): A-2004-1-4-LP-N Drawing Vendor(s): Digikey: AE10383-ND
J7 = openag-connectors:OPENAG-I2C-HEADER: Fits standard 100 mil header footprint; POPULATE: NO; VERIFIED: NO
J9 J10 = openag-connectors:PJ-036AH-SMT-TR: CUI Inc. - PJ-036AH-SMT-TR - CONN PWR JACK 2X5.5MM SOLDER Description: Power Barrel Connector Jack 2.10mm ID (0.083"), 5.50mm OD (0.217") Surface Mount, Right Angle Technical Specifications: Connector Type: Jack Gender: Male Industry Recognized Mating Diameter: 2.10mm ID (0.083"), 5.50mm OD (0.217") Actual Diameter: 0.078" (2.00mm ID), 0.248" (6.30mm OD) Number of Positions/Contacts: 2 Conductors, 3 Contacts Internal Switch(s): Single Switch, Normally Closed Mounting Type: Surface Mount, Right Angle Termination: Solder Shielding: Unshielded Voltage - Rated: 24VDC Current Rating: 5A Mating Length/Depth: 0.360" (9.15mm) Contact Material - Plating: Silver Operating Temperature: -25°C ~ 85°C Housing Material: Polyamide (PA6T), Nylon 6T Contact Material: Brass; Copper Alloy Body Color: Black Datasheet(s): PJ-036AH-SMT-TR Vendor(s): Digikey: CP-036AHPJCT-ND
L1-L6 = openag-inductors:120UH-ASPI-6045S-121M-TCT-ND: Abracon LLC - ASPI-6045S-121M-T - FIXED IND 120UH 700MA 484 MOHM Description: 120µH Shielded Wirewound Inductor 700mA 484 mOhm Nonstandard Technical Specifications: Type: Wirewound Material - Core: Ferrite Inductance: 120µH Tolerance: ±20% Current Rating: 700mA Current - Saturation: 850mA Shielding: Shielded DC Resistance (DCR): 484 mOhm Frequency - Self Resonant: 4.2MHz Operating Temperature: -40°C ~ 125°C Frequency - Test: 100kHz Mounting Type: Surface Mount Package / Case: Nonstandard Size / Dimension: 0.236" L x 0.236" W (6.00mm x 6.00mm) Height - Seated (Max): 0.177" (4.50mm) Datasheet(s): ASPI-6045S Series Datasheet ASPI-6045S Drawing Vendor(s): Digikey: ASPI-6045S-121M-TCT-ND; MF: Abracon LLC; MPN: ASPI-6045S-121M-T
L8 = openag-inductors:68UH-UP2B-680-R: Eaton - UP2B-680-R - FIXED IND 68UH 1.5A 178.7 MOHM Description: 68µH Unshielded Wirewound Inductor 1.5A 178.7 mOhm Max Nonstandard Technical Specifications: Type: Wirewound Material - Core: Ferrite Inductance: 68µH Tolerance: ±20% Current Rating: 1.5A Current - Saturation: 1.2A Shielding: Unshielded DC Resistance (DCR): 178.7 mOhm Max Operating Temperature: -40°C ~ 85°C Frequency - Test: 100kHz Mounting Type: Surface Mount Package / Case: Nonstandard Size / Dimension: 0.550" L x 0.410" W (13.97mm x 10.41mm) Height - Seated (Max): 0.236" (6.00mm) Datasheet(s): UNI-PAC (-R) Vendor(s): Digikey: 513-1083-1-ND
R1 R6-R9 R14 R26 R28 = openag-resistors:1K-ERJ-PB3D1001V: Panasonic - P20283CT-ND - RES SMD 1K OHM 0.5% 1/5W 0603 Description: 1 kOhms ±0.5% 0.2W, 1/5W Chip Resistor 0603 (1608 Metric) Automotive AEC-Q200, Pulse Withstanding Thick Film Technical Specifications: Resistance: 1 kOhms Tolerance: ±0.5% Power: 0.2W, 1/5W Operating Temperature: -55°C ~ 155°C Package / Case: 0603 (1608 Metric) Datasheet(s): ERJ-PB3, PB6 Series, High Precision Datasheet Vendor(s): Digikey: P20283CT-ND; POPULATE: YES; VERIFIED: NO
R2-R5 R29 = openag-resistors:0OHM-RC0603JR-070RL: Yageo - RC0603JR-070RL - RES SMD 0 OHM JUMPER 1/10W 0603 Description: 0 Ohms Jumper 0.1W, 1/10W Chip Resistor 0603 (1608 Metric) Moisture Resistant Thick Film Technical Specifications: Resistance: 0 Ohms Power: 0.1W, 1/10W Operating Temperature: -55°C ~ 155°C Package / Case: 0603 (1608 Metric) Datasheet(s): RC Series, L Datasheet Vendor(s): Digikey: 311-0.0GRCT-ND; POPULATE: YES; VERIFIED: NO
R11 R33 R40 = openag-resistors:100OHM-RC0603JR-07100RL: Yageo - RC0603JR-07100RL - RES SMD 100 OHM 5% 1/10W 0603 Description: 100 Ohms ±5% 0.1W, 1/10W Chip Resistor 0603 (1608 Metric) Moisture Resistant Thick Film Technical Specifications: Resistance: 100 Ohms Tolerance: ±5% Power (Watts): 0.1W, 1/10W Composition: Thick Film Features: Moisture Resistant Temperature Coefficient: ±100ppm/°C Operating Temperature: -55°C ~ 155°C Package / Case: 0603 (1608 Metric) Supplier Device Package: 0603 Size / Dimension: 0.063" L x 0.032" W (1.60mm x 0.80mm) Height - Seated (Max): 0.022" (0.55mm) Number of Terminations: 2 Datasheet(s): Thick Film Chip Resistor Intro Chip Resistor Marking RC Series, L Datasheet Vendor(s): Digikey: 311-100GRCT-ND; POPULATE: YES; VERIFIED: NO
R13 = openag-resistors:3.01K-RC0603FR-073K01L: Yageo - RC0603FR-073K01L - RES SMD 3.01K OHM 1% 1/10W 0603 Description: 3.01 kOhms ±1% 0.1W, 1/10W Chip Resistor 0603 (1608 Metric) Moisture Resistant Thick Film Technical Specifications: Resistance: 3.01 kOhms Tolerance: ±1% Power (Watts): 0.1W, 1/10W Composition: Thick Film Features: Moisture Resistant Temperature Coefficient: ±100ppm/°C Operating Temperature: -55°C ~ 155°C Package / Case: 0603 (1608 Metric) Supplier Device Package: 0603 Size / Dimension: 0.063" L x 0.032" W (1.60mm x 0.80mm) Height - Seated (Max): 0.022" (0.55mm) Number of Terminations: 2 Datasheet(s): Chip Resistor Marking RC Series, L Datasheet Vendor(s): Digikey: 311-3.01KHRCT-ND
R32 = openag-resistors:982OHM-RC0603FR-07976RL: Yageo - RC0603FR-07976RL - RES SMD 976 OHM 1% 1/10W 0603 Description: 976 Ohms ±1% 0.1W, 1/10W Chip Resistor 0603 (1608 Metric) Moisture Resistant Thick Film Technical Specifications: Resistance: 976 Ohms Tolerance: ±1% Power (Watts): 0.1W, 1/10W Composition: Thick Film Features: Moisture Resistant Temperature Coefficient: ±100ppm/°C Operating Temperature: -55°C ~ 155°C Package / Case: 0603 (1608 Metric) Supplier Device Package: 0603 Size / Dimension: 0.063" L x 0.032" W (1.60mm x 0.80mm) Height - Seated (Max): 0.022" (0.55mm) Number of Terminations: 2 Datasheet(s): Chip Resistor Marking RC Series, L Datasheet Vendor(s): Digikey: 311-976HRCT-ND
R42 R44-R46 = openag-resistors:600OHM-RC0603FR-07604RL: Yageo - RC0603FR-07604RL - RES SMD 604 OHM 1% 1/10W 0603 Description: 604 Ohms ±1% 0.1W, 1/10W Chip Resistor 0603 (1608 Metric) Moisture Resistant Thick Film Technical Specifications: Resistance: 604 Ohms Tolerance: ±1% Power (Watts): 0.1W, 1/10W Composition: Thick Film Features: Moisture Resistant Temperature Coefficient: ±100ppm/°C Operating Temperature: -55°C ~ 155°C Package / Case: 0603 (1608 Metric) Supplier Device Package: 0603 Size / Dimension: 0.063" L x 0.032" W (1.60mm x 0.80mm) Height - Seated (Max): 0.022" (0.55mm) Number of Terminations: 2 Datasheet(s): RC Series, L Datasheet Chip Resistor Marking Vendor(s): Digikey: 311-604HRCT-ND
R43 R47 = openag-resistors:120OHM-RC0603FR-07120RL: Yageo - RC0603FR-07120RL - RES SMD 120 OHM 1% 1/10W 0603 Description: 120 Ohms ±1% 0.1W, 1/10W Chip Resistor 0603 (1608 Metric) Moisture Resistant Thick Film Technical Specifications: Resistance: 120 Ohms Tolerance: ±1% Power (Watts): 0.1W, 1/10W Composition: Thick Film Features: Moisture Resistant Temperature Coefficient: ±100ppm/°C Operating Temperature: -55°C ~ 155°C Package / Case: 0603 (1608 Metric) Supplier Device Package: 0603 Size / Dimension: 0.063" L x 0.032" W (1.60mm x 0.80mm) Height - Seated (Max): 0.022" (0.55mm) Number of Terminations: 2 Datasheet(s): RC Series, L Datasheet Chip Resistor Marking Vendor(s): Digikey: 311-120HRCT-ND
R48 R49 R56-R62 = openag-resistors:10K-ERJ-3EKF1002V: Panasonic - ERJ-3EKF1002V - RES SMD 10K OHM 1% 1/10W 0603 Description: 10 kOhms ±1% 0.1W, 1/10W Chip Resistor 0603 (1608 Metric) Automotive AEC-Q200 Thick Film Technical Specifications: Resistance: 10kOhms Tolerance: ±1% Power: 0.1W, 1/10W Operating Temperature: -55°C ~ 155°C Package/Case: 0603 (1608 Metric) Datasheet(s): ERJ-3EKF1002V View All Specifications Vendor(s): Digikey: P10.0KHCT-ND; POPULATE: YES; VERIFIED: NO
SJ1 SJ3 SJ4 SJ6 SJ_A0 SJ_A1-SJ_A5 SJ_A16 SJ_A17 = openag-connectors:SOLDERJUMPER: SMD Solder JUMPER Solder the two pads together to create a connection, or remove the solder to break it. REFLOW - Use this footprint for solder paste and reflow ovens. WAVE - Use this footprint for hand-soldering (larger pads). CLOSED - Has a trace between the two pads to ensure it is closed by default. The trace needs to be cut to disable the jumper, and can be closed again by creating a solder bridge between the two pads.; POPULATE: YES; VERIFIED: NO
TP1-TP31 = openag-testpads:TP: Test pad
U1-U6 = openag-regulators:RCD-24-0.70/VREF: Recom Power - RCD-24-0.70/VREF - LED SUPPLY CC BUCK 2-35V 700MA Description: 700mA 2 ~ 35 V Constant Current LED Driver Buck Topology 1 Output Technical Specifications: Type: Constant Current Topology: Buck Number of Outputs: 1 Voltage - Input (Min): 4.5V Voltage - Input (Max): 36V Voltage - Output: 2 ~ 35 V Current - Output (Max): 700mA Power (Watts): 25W Dimming: Analog Features: SCP Operating Temperature: -40°C ~ 71°C Efficiency: 96% Mounting Type: Through Hole Package / Case: 6-DIP Module Size / Dimension: 0.87" L x 0.49" W x 0.33" H (22.1mm x 12.6mm x 8.5mm) Approvals: cULus Weight: 0.01 lb (4.54g) Datasheet(s): RCD-24 Series Datasheet Vendor(s): Digikey: 945-1806-5-ND; POPULATE: YES; VERIFIED: NO
U7 = openag-dacs:DAC5578SPW: Texas Instruments - DAC5578SPW Description: 8 Bit Digital to Analog Converter 8 16-TSSOP Technical Specifications: Number of Bits: 8-bit Number of D/A Converters: 8 Settling Time: 12us Operating Voltage: 2.7V - 5.5V Operating Temperature: -40° C to 125°C Max IDD (Normal Mode): 1.4mA Output Short Circuit Current (Individual): 25mA Datasheet(s): DAC5578,6578,7578 <http://www.ti.com/lit/ds/symlink/dac5578.pdf> Vendor(s): Digikey: 296-27736-5-ND <https://www.digikey.com/product-detail/en/texas-instruments/DAC5578SPW/296-27736-5-ND/2360827>; POPULATE: YES; VERIFIED: NO
U9 = openag-microcontrollers:CY8C4124PVI-432: Cypress - CY8C4124PVI-432 - IC MCU 32BIT 16KB FLASH 28SSOP Description: ARM® Cortex®-M0 PSOC® 4 CY8C41xx Microcontroller IC 32-Bit 24MHz 16KB (16K x 8) FLASH 28-SSOP Technical Specifications: Core Processor: ARM® Cortex®-M0 Core Size: 32-Bit Core Speed: 24 MHz Connectivity: I²C, IrDA, LIN, Microwire, SmartCard, SPI, SSP, UART/USART Peripherals: Brown-out Detect/Reset, LVD, POR, PWM, WDT Number of IO: 24 Program Memory Size: 16KB (16K x 8) Program Memory Type: FLASH RAM Size: 4K x 8 Supply Voltage: 1.71 V ~ 5.5 V Data Converters: A/D 8x12b Oscillator Type: Internal Operating Temperature: -40°C ~ 85°C (TA) Package / Case: 28-SSOP (0.209", 5.30mm Width) Datasheet(s): PSoC 4100 Family Vendor(s): Digikey: 428-3348-ND; POPULATE: YES; VERIFIED: NO
U10 = openag-isolators:ADM2481BRWZ-RL7: Analog Devices - ADM2481BRWZ-RL7 - DGTL ISO RS422/RS485 16SOIC Description: RS422, RS485 Digital Isolator 2500Vrms 3 Channel 500kbps 25kV/µs CMTI 16-SOIC (0.295", 7.50mm Width) Technical Specifications: Technology: Magnetic Coupling Type: RS422, RS485 Isolated Power: No Number of Channels: 3 Inputs - Side 1/Side 2: 2/1 Channel Type: Bidirectional Voltage - Isolation: 2500Vrms Common Mode Transient Immunity (Min): 25kV/µs Data Rate: 500kbps Rise / Fall Time (Typ): 600ns, 600ns (Max) Supply Voltage: 3.3 V ~ 5 V Operating Temperature: -40°C ~ 85°C Package / Case: 16-SOIC (0.295", 7.50mm Width) Datasheet(s): ADM2481 Vendor(s): Digikey: ADM2481BRWZ-RL7TR-ND
U12 = openag-regulators:LM2937IMP-3.3/NOPB: Texas Instruments - LM2937IMP-3.3/NOPB - IC REG LIN 3.3V 400MA SOT223-4 Description: Linear Voltage Regulator IC Positive Fixed 1 Output 3.3V 400mA SOT-223-4 Technical Specifications: Output Configuration: Positive Output Type: Fixed Number of Regulators: 1 Voltage - Input (Max): 26V Voltage - Output (Min/Fixed): 3.3V Voltage Dropout (Max): 1V @ 50mA Current - Output: 400mA Current - Quiescent (Iq): 2mA Current - Supply (Max): 1.25A Protection Features: Over Temperature, Reverse Polarity, Short Circuit Operating Temperature: -40°C ~ 85°C Mounting Type: Surface Mount Package / Case: TO-261-4, TO-261AA Supplier Device Package: SOT-223-4 Base Part Number: LM2937 Datasheet(s): LM2937-2.5, LM2937-3.3 Datasheet Vendor(s): Digikey: LM2937IMP-3.3/NOPBCT-ND; POPULATE: YES; VERIFIED: NO
U14 = openag-pwm:PCA9685PW/Q900,118: NXP USA Inc. - PCA9685PW/Q900,118 - IC LED DRVR LIN DIM 25MA 28TSSOP Description: LED Driver IC 16 Output Linear PWM Dimming 25mA 28-TSSOP Technical Specifications: Type: Linear Internal Switch(s): Yes Number of Outputs: 16 Voltage - Supply (Min): 2.3V Voltage - Supply (Max): 5.5V Voltage - Output: 5.5V Current - Output / Channel: 25mA Dimming: PWM Applications: Backlight Operating Temperature: -40°C ~ 85°C (TA) Mounting Type: Surface Mount Package / Case: 28-TSSOP (0.173", 4.40mm Width) Supplier Device Package: 28-TSSOP Base Part Number: PCA9685 Datasheet(s): LED Controllers Leaflet PCA9685 Vendor(s): Digikey: 568-5931-1-ND
U15 = openag-buffers:PCA9615DPJ: NXP USA Inc. - PCA9615DPJ - IC REDRIVER I2C 2CH 10TSSOP Description: Buffer, ReDriver 2 Channel 400kHz 10-TSSOP Technical Specifications: Type: Buffer, ReDriver Applications: I²C Input: 2-Wire Bus Output: 2-Wire Bus Data Rate (Max): 400kHz Number of Channels: 2 Capacitance - Input: 7pF Voltage - Supply: 2.3 V ~ 5.5 V Current - Supply: 16µA Operating Temperature: -40°C ~ 85°C Package / Case: 10-TFSOP, 10-MSOP (0.118", 3.00mm Width) Supplier Device Package: 10-TSSOP Base Part Number: PCA9615 Datasheet(s): PCA9615DP Vendor(s): Digikey: 568-11484-1-ND
U16 = openag-regulators:MIC4680YM-TR: Microchip Technology - MIC4680YM-TR - IC REG BUCK BOOST ADJ 1.3A 8SOIC Description: Buck, Buck-Boost Switching Regulator IC Positive Adjustable 1.23V 1 Output 1.3A 8-SOIC (0.154", 3.90mm Width) Technical Specifications: Function: Step-Down, Step-Up/Step-Down Output Configuration: Positive Topology: Buck, Buck-Boost Output Type: Adjustable Number of Outputs: 1 Voltage - Input (Min): 4V Voltage - Input (Max): 34V Voltage - Output (Min/Fixed): 1.23V Voltage - Output (Max): 32.98V Current - Output: 1.3A Frequency - Switching: 200kHz Synchronous Rectifier: No Operating Temperature: -40°C ~ 125°C (TJ) Mounting Type: Surface Mount Package / Case: 8-SOIC (0.154", 3.90mm Width) Supplier Device Package: 8-SOIC Base Part Number: MIC4680 Datasheet(s): MIC4680 Vendor(s): Digikey: 576-1222-1-ND